# Altium schematic sheet expansionLED.SchDoc
size A; SheetNumber: 1; SheetTotal: 1
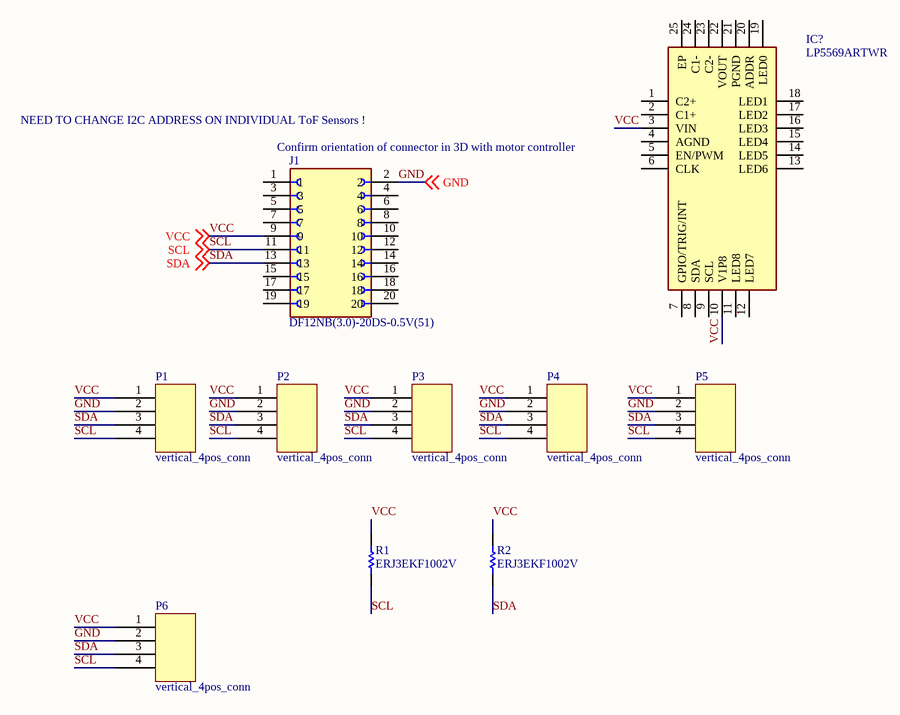
[diagram p0: expansionLED.SchDoc]

## Parts
IC?  LP5569ARTWR  [QFN50P400X400X80-25N-D]
J1  DF12NB(3.0)-20DS-0.5V(51)  [HRS_DF12NB(3.0)-20DS-0.5V(51)]
P1  vertical_4pos_conn  [vertical_4pos_conn _s_square]
P2  vertical_4pos_conn  [vertical_4pos_conn _s_square]
P3  vertical_4pos_conn  [vertical_4pos_conn _s_square]
P4  vertical_4pos_conn  [vertical_4pos_conn _s_square]
P5  vertical_4pos_conn  [vertical_4pos_conn _s_square]
P6  vertical_4pos_conn  [4pos_conn_tof]
R1  ERJ3EKF1002V  [RESC1609X55X30LL15T15]
R2  ERJ3EKF1002V  [RESC1609X55X30LL15T15]

## Nets
GND: J1.2 P1.2 P2.2 P3.2 P4.2 P5.2 P6.2 ; off-sheet GND
SCL: J1.11 P1.4 P2.4 P3.4 P4.4 P5.4 P6.4 R1.1 ; off-sheet SCL
SDA: J1.13 P1.3 P2.3 P3.3 P4.3 P5.3 P6.3 R2.1 ; off-sheet SDA
VCC: IC?.3(VIN) IC?.10(V1P8) J1.9 P1.1 P2.1 P3.1 P4.1 P5.1 P6.1 R1.2 R2.2 ; off-sheet VCC

Not connected (* = marked no-connect by the designer): IC? 1(C2+) 2(C1+) 4(AGND) 5(EN/PWM) 6(CLK) 7(GPIO/TRIG/INT) 8(SDA) 9(SCL) 11(LED8) 12(LED7) 13(LED6) 14(LED5) 15(LED4) 16(LED3) 17(LED2) 18(LED1) 19(LED0) 20(ADDR) 21(PGND) 22(VOUT) 23(C2-) 24(C1-) 25(EP); J1 1 3 4 5 6 7 8 10 12 14 15 16 17 18 19 20

## Notes on the sheet
- NEED TO CHANGE I2C ADDRESS ON INDIVIDUAL ToF Sensors !
- Confirm orientation of connector in 3D with motor controller

## Library data of the parts
IC? = LP5569ARTWR: Integrated Circuit; Manufacturer_Name: Texas Instruments; Datasheet Link: http://www.ti.com/lit/gpn/lp5569; Height: 0.8mm; Manufacturer_Part_Number: LP5569ARTWR; Mouser Part Number: 595-LP5569ARTWR; Mouser Price/Stock: https://www.mouser.co.uk/ProductDetail/Texas-Instruments/LP5569ARTWR?qs=F5EMLAvA7IBYIi%2FnZOI3GQ%3D%3D; Arrow Part Number: LP5569ARTWR; Arrow Price/Stock: https://www.arrow.com/en/products/lp5569artwr/texas-instruments?region=nac
R1 R2 = CMP-1012-00623-3: Chip Resistor, 10 KOhm, +/- 1%, 0.1 W, -55 to 155 degC, 0603 (1608 Metric), RoHS, Tape and Reel; Manufacturer: Panasonic; Voltage Rating: 75V; Case\/Package: 0603; Power Rating: 100mW; Resistance: 10KOhm; Temperature Coefficient: 100ppm\/degreesC; Number of Pins: 2; Package Reference: 603; Depth: 0.8mm; Mount: SurfaceMount; Package Description: 2-Pin Surface Mount Device, Body 1.6 x 0.85 mm; Datasheet Version: 02/2017; Length: 1.6mm; Lead Free: LeadFree; Height: 0.45mm; Number of Terminations: 2; Max Power Dissipation: 100mW; Min Operating Temperature: -55degC; Datasheet URL: https://industrial.panasonic.com/cdbs/www-data/pdf/RDA0000/AOA0000C304.pdf; Termination: SMD/SMT; Case Code (Metric): 1608; Case Code (Imperial): 0603; Tolerance: 1%; Max Operating Temperature: 155degC; RoHSCompliant: true; Voltage Rating (DC): 75V; Radiation Hardening: No; Packaging: TapeandReel; Composition: ThickFilm; Mounting Technology: SurfaceMount; Manufacturer URL: http://www.panasonic.com/; Width: 0.031inch; REACH SVHC: NoSVHC; Contact Plating: Tin; Military Standard: Not; Package Quantity: 1
J1 = DF12NB(3.0)-20DS-0.5V(51): Value: *; Availability: Unavailable; Package: None; Price: None; MP: DF12NB(3.0)-20DS-0.5V(51)